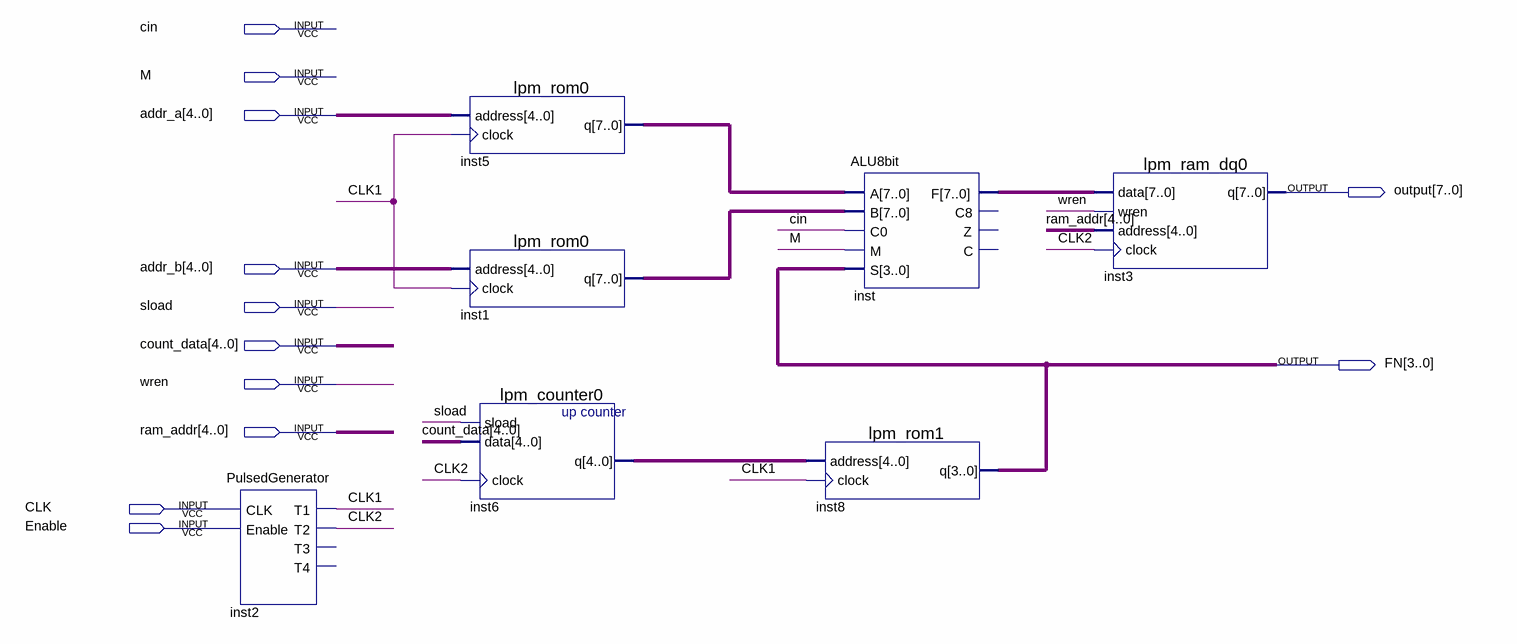
[diagram p0: schematic sheet]
// Quartus schematic SimpleCPU.bdf as structural Verilog: 7 symbols, 12 pins
module SimpleCPU (
  input  cin,
  input  M,
  input  [4:0] addr_a,
  input  [4:0] addr_b,
  input  sload,
  input  [4:0] count_data,
  input  wren,
  input  [4:0] ram_addr,
  input  CLK,
  input  Enable,
  output [7:0] \output ,
  output [3:0] FN
);

  wire CLK1, CLK2;
  wire [4:0] inst6_q;
  wire [7:0] inst1_q, inst5_q, inst_f;

  PulsedGenerator inst2 (.CLK(CLK), .Enable(Enable), .T1(CLK1), .T2(CLK2));  // open: T3, T4
  lpm_rom0 inst5 (.address(addr_a), .clock(CLK1), .q(inst5_q));
  lpm_rom0 inst1 (.address(addr_b), .clock(CLK1), .q(inst1_q));
  lpm_counter0 inst6 (.sload(sload), .data(count_data), .clock(CLK2), .q(inst6_q));
  ALU8bit inst (.A(inst5_q), .B(inst1_q), .C0(cin), .M(M), .S(FN), .F(inst_f));  // open: C8, Z, C
  lpm_rom1 inst8 (.address(inst6_q), .clock(CLK1), .q(FN));
  lpm_ram_dq0 inst3 (.data(inst_f), .wren(wren), .address(ram_addr), .clock(CLK2), .q(\output ));
endmodule
